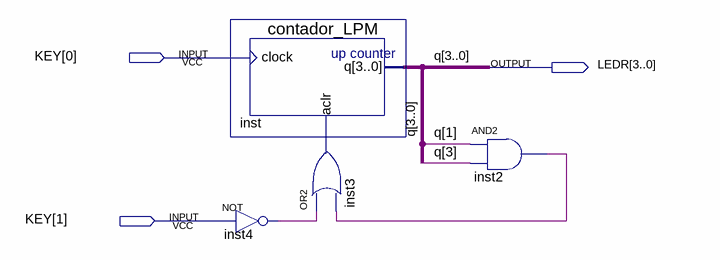
[diagram p0: schematic sheet]
// Quartus schematic Exercicio_1.bdf as structural Verilog: 4 symbols, 3 pins
module Exercicio_1 (
  input  [1:0] KEY,
  output [3:0] LEDR
);

  wire inst2_out, inst3_out, inst4_out;

  contador_LPM inst (.clock(KEY[0]), .aclr(inst3_out), .q(LEDR));
  not inst4 (inst4_out, KEY[1]);
  or inst3 (inst3_out, inst4_out, inst2_out);
  and inst2 (inst2_out, LEDR[1], LEDR[3]);

  // Other names for the same wires on the sheet: q[3:0] = LEDR
endmodule
